# Altium schematic sheet sensor.SchDoc: Bison-Board
size A4; DrawnBy: mzy2364; Revision: V1.4
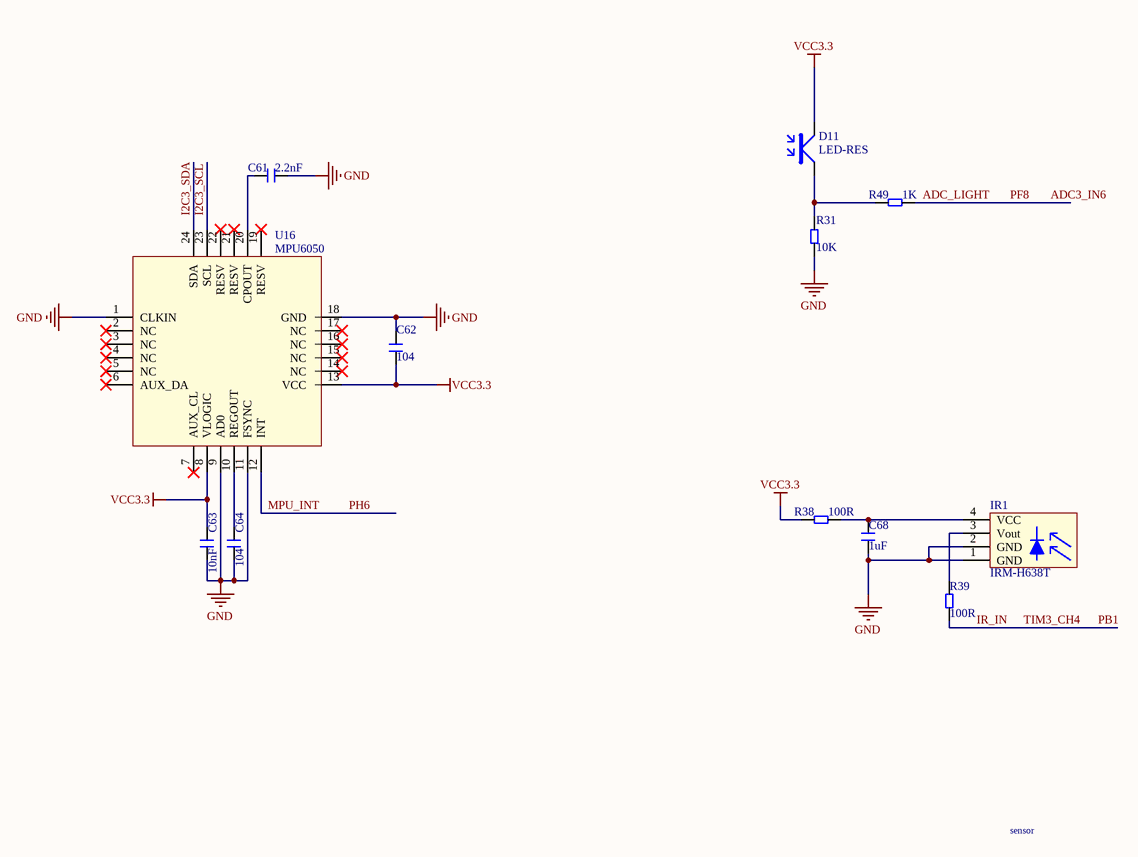
[diagram p0: sensor.SchDoc]

## Parts
C61  2.2nF  [C 0603]
C62  104  [C 0603]
C63  10nF  [C 0603]
C64  104  [C 0603]
C68  1uF  [C 0603]
D11  LED-RES  [LED 0805]
IR1  IRM-H638T  [IRM-H638T]
R31  10K  [R 0603]
R38  100R  [R 0603]
R39  100R  [R 0603]
R49  1K  [R 0603]
U16  MPU6050  [QFN24]

## Nets
GND: C61.2 C62.2 C63.1 C64.1 C68.1 IR1.1(GND) IR1.2(GND) R31.1 U16.1(CLKIN) U16.9(AD0) U16.11(FSYNC) U16.18(GND)
VCC3.3: C62.1 C63.2 D11.2 R38.1 U16.8(VLOGIC) U16.13(VCC)
ADC3_IN6: R49.1  [also labelled ADC_LIGHT, PF8]
I2C3_SCL: U16.23(SCL)
I2C3_SDA: U16.24(SDA)
IR_IN: R39.2  [also labelled PB1, TIM3_CH4]
MPU_INT: U16.12(INT)  [also labelled PH6]
NetC61_1: C61.1 U16.20(CPOUT)
NetC64_2: C64.2 U16.10(REGOUT)
NetC68_2: C68.2 IR1.4(VCC) R38.2
NetD11_1: D11.1 R31.2 R49.2
NetIR1_3: IR1.3(Vout) R39.1

Not connected (* = marked no-connect by the designer): U16 2(NC)* 3(NC)* 4(NC)* 5(NC)* 6(AUX_DA)* 7(AUX_CL)* 14(NC)* 15(NC)* 16(NC)* 17(NC)* 19(RESV)* 21(RESV)* 22(RESV)*

## Notes on the sheet
- sensor

## Library data of the parts
C61-C64 C68 = CAP
D11 = LRES: 光敏传感器
R31 R38 R39 R49 = RES
U16 = MPU6050: 六轴姿态传感器